# EAGLE design potenciostat (EAGLE 9.3.2)
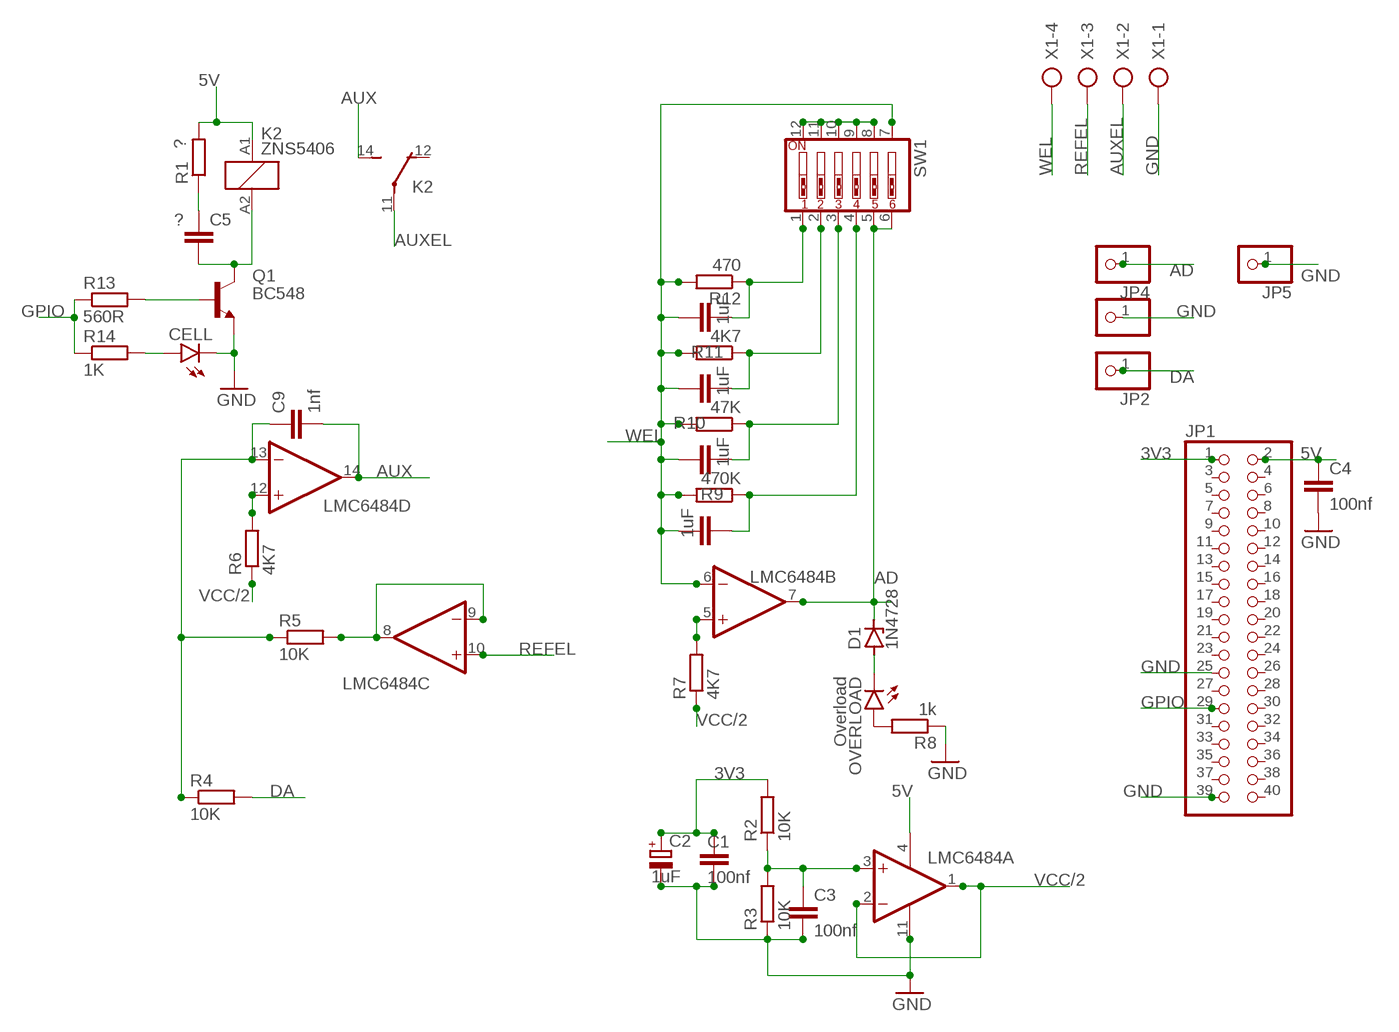
[diagram p0: schematic, sheet 1]

## Parts
C1  100nf  C-EU050-035X075  [C050-035X075]
C2  1uF  CPOL-EUE2.5-5  [E2,5-5]
C3  100nf  C-EU050-035X075  [C050-035X075]
C4  100nf  C-EU050-035X075  [C050-035X075]
C5  ?  C-EU050-035X075  [C050-035X075]
C6  1uF  C-EU050-035X075  [C050-035X075]
C7  1uF  C-EU050-035X075  [C050-035X075]
C8  1uF  C-EU050-035X075  [C050-035X075]
C9  1nf  C-EU050-035X075  [C050-035X075]
C10  1uF  C-EU050-035X075  [C050-035X075]
CELL  TLLG4400  [LED3MM]
D1  1N4728  [DO41Z10]
JP1  PINHD-2X20/90  [2X20/90]
JP2  PINHD-1X1  [1X01]
JP3  PINHD-1X1  [1X01]
JP4  PINHD-1X1  [1X01]
JP5  PINHD-1X1  [1X01]
K2  ZNS5406  [ZN5]
LMC6484  TL074P  [DIL14]
OVERLOAD  Overload  TLLG4400  [LED3MM]
Q1  BC548  [TO92-EBC]
R1  ?  R-EU_0207/7  [0207/7]
R2  10K  R-EU_0207/7  [0207/7]
R3  10K  R-EU_0207/7  [0207/7]
R4  10K  R-EU_0207/7  [0207/7]
R5  10K  R-EU_0207/7  [0207/7]
R6  4K7  R-EU_0207/7  [0207/7]
R7  4K7  R-EU_0207/7  [0207/7]
R8  1k  R-EU_0207/7  [0207/7]
R9  470K  R-EU_0207/7  [0207/7]
R10  47K  R-EU_0207/7  [0207/7]
R11  4K7  R-EU_0207/7  [0207/7]
R12  470  R-EU_0207/7  [0207/7]
R13  560R  R-EU_0207/7  [0207/7]
R14  1K  R-EU_0207/7  [0207/7]
SW1  SW_DIP-6  [EDG-06]
X1  AK500/4  [AK500/4]

## Nets
3V3: C1.1 C2.+ JP1.1 R2.2
5V: C4.1 JP1.2 K2.A1 LMC6484.4(P:V+) R1.2
AD: D1.C JP4.1 LMC6484.7(B:OUT) SW1.5 SW1.6
AUX: C9.2 K2.14(2:S) LMC6484.14(D:OUT)
AUXEL: K2.11(2:P) X1.2
DA: JP2.1 R4.2
GND: C1.2 C2.- C3.2 C4.2 CELL.K(C) JP1.25 JP1.39 JP3.1 JP5.1 LMC6484.11(P:V-) Q1.E R3.1 R8.1 X1.1
GPIO: JP1.29 R13.1 R14.1
N$1: OVERLOAD.A R8.2
N$2: LMC6484.8(C:OUT) LMC6484.9(C:-IN) R5.2
N$3: C3.1 LMC6484.3(A:+IN) R2.1 R3.2
N$4: C9.1 LMC6484.13(D:-IN) R4.1 R5.1
N$5: C5.1 R1.1
N$6: LMC6484.12(D:+IN) R6.2
N$7: C7.2 R12.1 SW1.1
N$8: LMC6484.5(B:+IN) R7.2
N$9: SW1.8 SW1.9 SW1.10 SW1.11 SW1.12
N$10: D1.A OVERLOAD.K(C)
N$11: C8.2 R11.1 SW1.2
N$12: C10.2 R10.1 SW1.3
N$13: C6.2 R9.1 SW1.4
N$15: C5.2 K2.A2 Q1.C
N$16: CELL.A R14.2
N$18: Q1.B R13.2
REFEL: LMC6484.10(C:+IN) X1.3
VCC/2: LMC6484.1(A:OUT) LMC6484.2(A:-IN) R6.1 R7.1
WEL: C6.1 C7.1 C8.1 C10.1 LMC6484.6(B:-IN) R9.2 R10.2 R11.2 R12.2 SW1.7 X1.4
Unconnected: JP1.3 JP1.4 JP1.5 JP1.6 JP1.7 JP1.8 JP1.9 JP1.10 JP1.11 JP1.12 JP1.13 JP1.14 JP1.15 JP1.16 JP1.17 JP1.18 JP1.19 JP1.20 JP1.21 JP1.22 JP1.23 JP1.24 JP1.26 JP1.27 JP1.28 JP1.30 JP1.31 JP1.32 JP1.33 JP1.34 JP1.35 JP1.36 JP1.37 JP1.38 JP1.40 K2.12(2:O)

## Library data of the parts
C1 C3-C10 = rcl:C-EU: CAPACITOR, European symbol; SPICEPREFIX: C
C2 = rcl:CPOL-EU: POLARIZED CAPACITOR, European symbol; SPICEPREFIX: C
CELL OVERLOAD = led:TLLG4400: Low Current (2mA) LED 3 mm Tinted Diffused Package color GREEN Source: Data sheet <http://www.farnell.com/datasheets/391098.pdf>; MF: VISHAY SEMICONDUCTOR; OC_FARNELL: 1612435
D1 = diode:1N4728: Z DIODE 3.3 V, 1W, 5 percent
JP1 = pinhead:PINHD-2X20: PIN HEADER
JP2-JP5 = pinhead:PINHD-1X1: PIN HEADER
K2 = relay:ZNS5*: Miniature Power PCB Relay SCHRACK 1pole 10 A Source: http://www.schrack.com/.. 5847.pdf; OC_FARNELL: unknown; OC_NEWARK: unknown
LMC6484 = linear:TL074: OP AMP
Q1 = transistor-npn:BC548*: NPN Transistor
R1-R14 = rcl:R-EU_: RESISTOR, European symbol; SPICEPREFIX: R
SW1 = special:SW_DIP-6: DIP SWITCH
X1 = con-ptr500:AK500/4: CONNECTOR; OC_FARNELL: unknown; OC_NEWARK: unknown

## Board
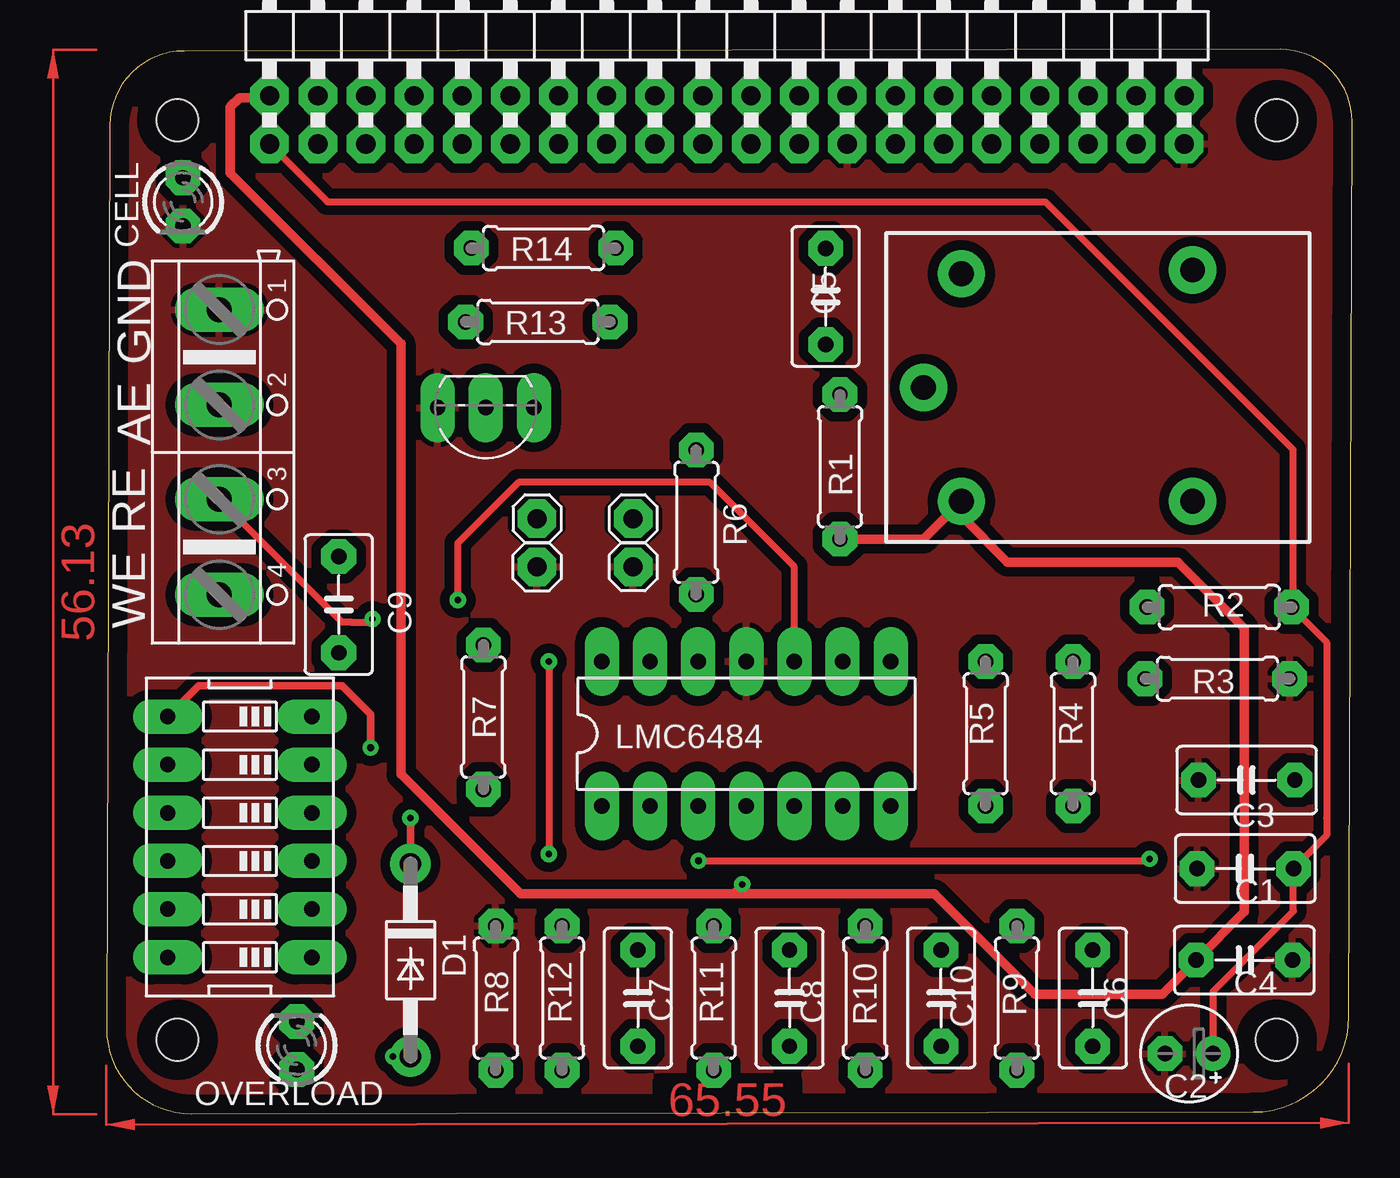
[diagram p1: board, top side]
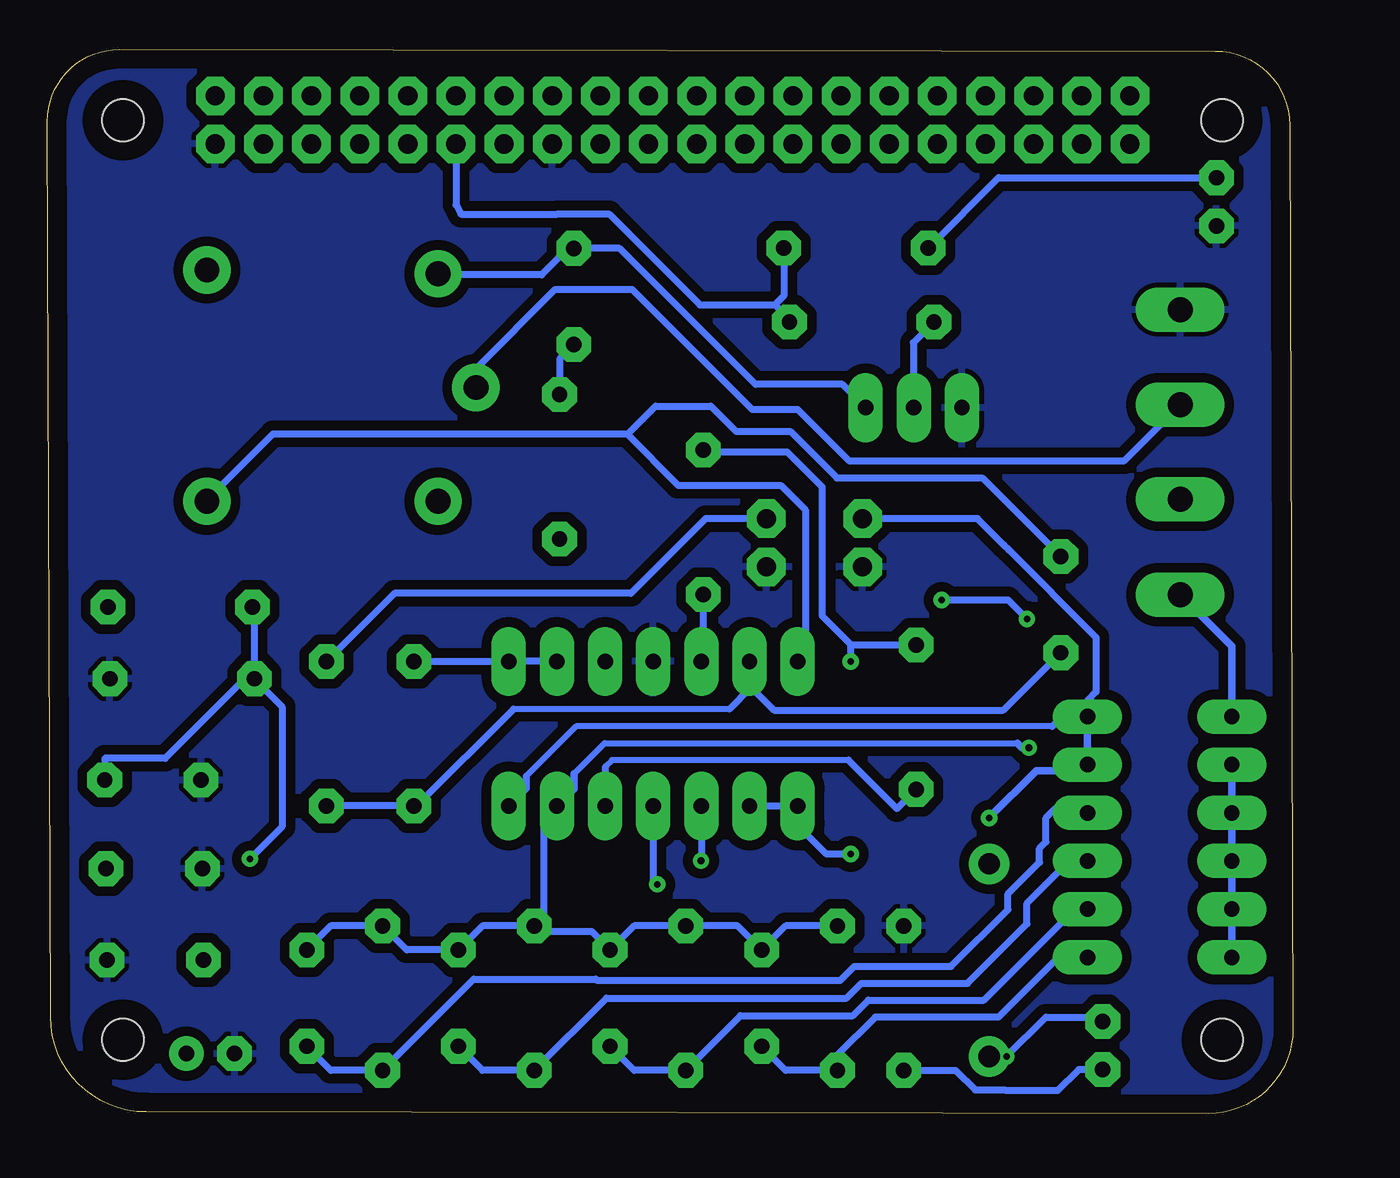
[diagram p2: board, bottom side, seen from below]

Size 65.72 x 56.13 mm. Coordinates in mm from the lower left corner, seen from the top.
Outline: 0.17,52.14 0,4.47 arc90 4.46,0 60.51,0.09 arc90 65.55,5.11 65.72,52.32 arc90 61.92,56.13 4.08,56.05 arc90 0.17,52.14
Copper layers (1*16): Top 0.035mm / dielectric 1.5mm / Bottom 0.035mm
Design rules "default *": minimum track width 15mil, minimum drill 0.35mm, track to track 20mil, track to pad 20mil, pad to pad 20mil, via to via 6mil, smd to smd 6mil, copper to edge 40mil, drill to drill 6mil, minimum pad ring 20mil, minimum via ring 10mil, stop-mask expansion 4mil, vias tented up to drill 0mil, thermal gap 10mil
Holes 2.2 mm at 3.73,52.39 61.73,3.89 3.73,3.89 61.73,52.39

### Footprints (pad centres in the part's own frame; a part is rotated, then mirrored left to right if it is on the bottom)
C050-035X075 = drill 0.813 octagon: 1 -2.54,0; 2 2.54,0
E2,5-5 = drill 0.813 pad 1.6: + -1.27,0 | drill 0.813 pad 1.6 octagon: - 1.27,0
LED3MM = drill 0.813 octagon: A -1.27,0; K 1.27,0
DO41Z10 = drill 1.118: A 5.08,0; C -5.08,0
2X20/90 = drill 1.016 octagon: 1 -24.13,-6.35; 2 -24.13,-3.81; 3 -21.59,-6.35; 4 -21.59,-3.81; 5 -19.05,-6.35; 6 -19.05,-3.81; 7 -16.51,-6.35; 8 -16.51,-3.81; 9 -13.97,-6.35; 10 -13.97,-3.81; 11 -11.43,-6.35; 12 -11.43,-3.81; 13 -8.89,-6.35; 14 -8.89,-3.81; 15 -6.35,-6.35; 16 -6.35,-3.81; 17 -3.81,-6.35; 18 -3.81,-3.81; 19 -1.27,-6.35; 20 -1.27,-3.81; 21 1.27,-6.35; 22 1.27,-3.81; 23 3.81,-6.35; 24 3.81,-3.81; 25 6.35,-6.35; 26 6.35,-3.81; 27 8.89,-6.35; 28 8.89,-3.81; 29 11.43,-6.35; 30 11.43,-3.81; 31 13.97,-6.35; 32 13.97,-3.81; 33 16.51,-6.35; 34 16.51,-3.81; 35 19.05,-6.35; 36 19.05,-3.81; 37 21.59,-6.35; 38 21.59,-3.81; 39 24.13,-6.35; 40 24.13,-3.81
1X01 = drill 1.016 octagon: 1 0,0
ZN5 = drill 1.3 pad 2.5: 11 8.89,0; 12 -5.31,-6.2; 14 -5.31,6; A1 6.89,6; A2 6.89,-6
DIL14 = drill 0.813 long: 1 -7.62,-3.81; 2 -5.08,-3.81; 3 -2.54,-3.81; 4 0,-3.81; 5 2.54,-3.81; 6 5.08,-3.81; 7 7.62,-3.81; 8 7.62,3.81; 9 5.08,3.81; 10 2.54,3.81; 11 0,3.81; 12 -2.54,3.81; 13 -5.08,3.81; 14 -7.62,3.81
TO92-EBC = drill 0.813 long: B 0,-1.27; C -2.54,-1.27; E 2.54,-1.27
0207/7 = drill 0.813 octagon: 1 -3.81,0; 2 3.81,0
EDG-06 = drill 0.813 long: 1 -6.35,-3.81; 2 -3.81,-3.81; 3 -1.27,-3.81; 4 1.27,-3.81; 5 3.81,-3.81; 6 6.35,-3.81; 7 6.35,3.81; 8 3.81,3.81; 9 1.27,3.81; 10 -1.27,3.81; 11 -3.81,3.81; 12 -6.35,3.81
AK500/4 = drill 1.321 long: 1 -7.518,0; 2 -2.489,0; 3 2.489,0; 4 7.518,0

### Placement (x,y rotation side)
C1  60.08,12.92 180 top
C2  57.12,3.17 180 top
C3  60.15,17.59 180 top
C4  60.03,8.09 0 top
C5  37.94,43.1 90 top
C6  52.03,6.09 270 top
C7  28.03,6.09 270 top
C8  36.03,6.09 270 top
C9  12.24,26.85 90 top
C10  44.03,6.09 270 top
CELL  4.03,48.09 270 top
D1  16.03,8.09 270 top
JP1  32.73,57.49 0 top
JP2  27.78,31.38 0 top
JP3  22.71,28.84 90 top
JP4  22.71,31.38 0 top
JP5  27.78,28.84 0 top
K2  51.99,38.3 180 top
LMC6484  33.75,20.04 0 top
OVERLOAD  10.03,3.59 90 top
Q1  20.01,35.96 180 top
R1  38.69,34.12 270 top
R2  58.71,26.72 0 top
R3  58.61,22.94 180 top
R4  50.99,20.04 90 top
R5  46.38,20.04 90 top
R6  31.11,31.19 270 top
R7  19.88,20.92 270 top
R8  20.53,6.09 270 top
R9  48.03,6.09 90 top
R10  40.03,6.09 90 top
R11  32.03,6.09 90 top
R12  24.03,6.09 90 top
R13  22.75,41.76 180 top
R14  23.05,45.65 180 top
SW1  7.03,14.59 90 top
X1  5.95,34.89 270 top

### Tracks (layer width: path | path; a pad name or v marks a point on that pad's centre or on a via)
3V3
  Top 0.381: R2.2 62.59,26.65 | 62.59,26.65 64.38,24.86 64.38,15.6 64.38,14.68 C1.1 62.62,10.68 58.39,6.45 C2.+ | JP1.1 11.65,48.09 49.53,48.09 62.59,35.04 62.59,26.65
5V  (via drill 0.35)
  Top 0.381: 33.03,11.59 v33.53,12.09
  Top 0.406: JP1.2 8.22,53.68
  Top 0.508: JP1.2 8.51,53.59 7.03,53.59 6.53,53.09 6.53,49.59 15.53,40.59 15.53,17.89 21.83,11.59 33.03,11.59 43.69,11.59 48.99,6.29 55.69,6.29 C4.1 60.03,10.63 60.03,25.59 56.53,29.09 47.53,29.09 45.1,31.52 K2.A1 43.11,30.31 R1.2
  Bottom 0.381: 33.53,16.01 LMC6484.4 33.75,12.31 v33.53,12.09
AD  (via drill 0.35)
  Top 0.406: v16.03,15.59 D1.C
  Bottom 0.305: 12.7,20.43 37.83,20.43 40.44,17.81
  Bottom 0.381: 12.7,20.43 12.18,20.94 SW1.6 10.84,21.78 10.38,22.24 10.38,25.12 14.99,29.73 15.24,29.98 16.64,31.38 JP4.1 | LMC6484.7 40.44,17.16 40.44,17.81
  Bottom 0.406: SW1.6 SW1.5 11.15,18.09 13.53,18.09 v16.03,15.59
AUX
  Bottom 0.381: K2.14 57.3,32.36 53.81,35.85 35.14,35.85 35.11,35.82 | LMC6484.14 25.72,24.26 25.72,31.84 27.02,33.14 32.43,33.14 35.11,35.82 | 35.11,35.82 33.63,37.31 30.7,37.31 29.38,35.99 26.52,35.99 24.07,33.53 16.39,33.53 C9.2
AUXEL
  Bottom 0.381: K2.11 43.1,39.3 38.93,43.47 34.86,43.47 28.53,37.14 26.13,37.14 23.43,34.44 8.89,34.44 X1.2 5.99,37.34
DA
  Bottom 0.381: R4.2 47.4,27.44 34.93,27.44 30.99,31.38 JP2.1
GND
  pour Top: 0.03,0.09 0.03,56.09 65.53,56.09 65.53,0.09
  pour Bottom: 0.03,56.09 0.03,0.09 65.53,0.09 65.53,56.09
GPIO
  Bottom 0.381: JP1.29 44.16,47.93 43.89,47.44 38.82,47.44 38.81,47.45 36.09,47.45 31.29,42.66 27.33,42.66 | R14.1 26.86,43.13 27.33,42.66 | R13.1 26.56,41.89 27.33,42.66
N$1
  Bottom 0.381: OVERLOAD.A 11.3,2.32 12.41,1.22 13.03,1.22 15.03,1.22 15.16,1.22 15.19,1.25 16.76,1.25 17.8,2.28 R8.2
N$2
  Bottom 0.381: R5.2 LMC6484.8 LMC6484.9
N$3  (via drill 0.35)
  Top 0.381: 31.21,13.36 v31.23,13.34 54.93,13.34 v55.03,13.44
  Bottom 0.381: R2.1 54.8,26.62 R3.2 | R3.2 55.3,22.94 59.5,18.74 62.69,18.74 C3.1 | v55.03,13.44 53.33,15.14 53.33,21.47 R3.2 | LMC6484.3 31.21,13.36 v31.23,13.34
N$4
  Bottom 0.305: 29.73,21.34 41.13,21.34
  Bottom 0.381: R4.1 R5.1 46.24,16.23 41.13,21.34 | 29.73,21.34 28.67,22.4 LMC6484.13 28.67,22.58 27.37,21.28 15.28,21.28 C9.1
N$5
  Bottom 0.381: C5.1 38.69,39.81 R1.1
N$6
  Bottom 0.381: LMC6484.12 31.11,23.95 R6.2
N$7
  Bottom 0.381: C7.2 26.76,2.28 R12.1 24.03,3.09 22.03,5.09 15.53,5.09 12.38,8.24 SW1.1
N$8
  Bottom 0.305: 36.26,18.31 35.94,18.64 23.44,18.64
  Bottom 0.381: LMC6484.5 36.26,16.26 36.26,18.31 | 23.44,18.64 20.89,16.09 R7.2
N$9
  Bottom 0.406: SW1.8 SW1.9 SW1.10 SW1.11 SW1.12
N$10  (via drill 0.35)
  Top 0.381: D1.A v15.11,3.01
  Bottom 0.381: v15.11,3.01 13.03,5.09 10.26,5.09 OVERLOAD.K
N$11
  Bottom 0.381: C8.2 34.76,2.28 R11.1 29.15,5.17 23.21,5.17 22.4,5.98 16.3,5.98 12.19,10.09 11.03,10.09 10.84,10.28 SW1.2
N$12
  Bottom 0.381: C10.2 42.76,2.28 R10.1 36.22,6.09 23.54,6.09 22.77,6.87 17.17,6.87 14.03,10.01 14.03,11.09 11.8,13.32 SW1.3
N$13
  Bottom 0.381: C6.2 50.76,2.28 R9.1 43.22,7.09 36.77,7.09 36.7,7.02 23.88,7.02 23.14,7.76 18.03,7.76 15.03,10.76 15.03,11.59 13.37,13.26 13.37,13.99 13.03,14.33 13.03,15.59 12.53,16.09 11.07,16.09 SW1.4
N$15
  Bottom 0.381: K2.A2 45.04,44.24 39.64,44.24 38.24,45.64 C5.2 35.53,45.64 28.35,38.46 23.77,38.46 Q1.C
N$16
  Bottom 0.381: 18.71,46.18 R14.2 15.53,49.36 CELL.A
N$18
  Bottom 0.381: R13.2 20.03,40.67 20.03,37.26 Q1.B
REFEL  (via drill 0.35)
  Top 0.381: LMC6484.10 36.29,28.83 31.83,33.29 21.73,33.29 18.53,30.09 v18.53,27.09 | v14.03,26.09 13.84,25.9 12.93,25.9 12.91,25.92 12.43,25.92 X1.3
  Bottom 0.381: v18.53,27.09 15.03,27.09 v14.03,26.09
VCC/2  (via drill 0.35)
  Top 0.381: v23.34,23.85 v23.34,13.69
  Bottom 0.381: LMC6484.2 LMC6484.1 | 25.71,16.23 LMC6484.1 | 30.95,34.84 R6.1 31.01,34.9 26.69,34.9 24.83,33.04 24.83,26.24 23.32,24.73 | 23.32,24.73 R7.1 | 23.32,24.73 23.27,24.68 23.34,24.61 v23.34,23.85 | v23.34,13.69 24.61,13.69 26.13,15.21 LMC6484.1
WEL  (via drill 0.35)
  Top 0.406: v13.93,19.29 13.93,21.07 12.43,22.57 4.85,22.57 SW1.7
  Bottom 0.305: 37.92,17.93 36.31,19.54 14.54,19.54
  Bottom 0.381: LMC6484.6 39.03,16.03 | 38.99,16.07 LMC6484.6 | R12.2 26.76,9.9 C7.1 29.3,9.9 R11.2 34.76,9.9 C8.1 36.99,9.59 39.72,9.59 R10.2 | R10.2 42.76,9.9 C10.1 46.76,8.63 R9.2 50.76,9.9 C6.1 | LMC6484.6 39.53,15.53 39.53,10.4 R10.2
  Bottom 0.406: X1.4 3.22,24.64 SW1.7 | LMC6484.6 37.92,17.14 37.92,17.93 | 14.54,19.54 14.3,19.29 v13.93,19.29
(copper drawn outside any net)
  shapes: Top area x2

### Text on the board
tNames: GND | AE | RE | WE